# Altium schematic sheet Power.SchDoc
size A; DocumentNumber: 5; SheetNumber: 5; SheetTotal: 5
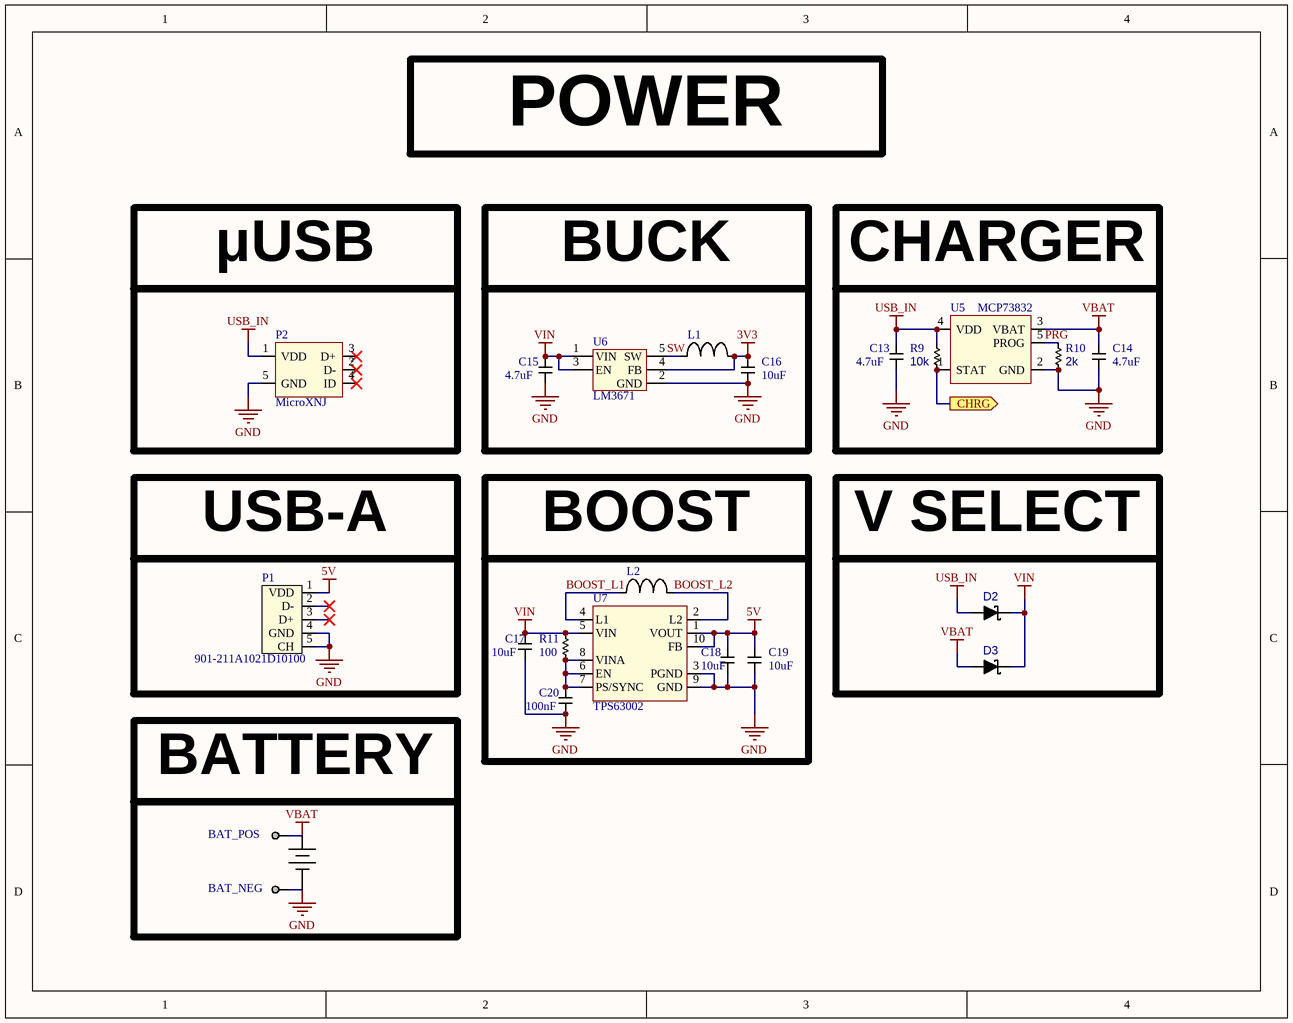
[diagram p0: Power.SchDoc]

## Parts
BAT_NEG  18 AWG Hole  [18 AWG Hole]  (value not drawn)  (no BOM)
BAT_POS  18 AWG Hole  [18 AWG Hole]  (value not drawn)  (no BOM)
C13  4.7uF  [CAP_0402_HIGH]
C14  4.7uF  [CAP_0402_HIGH]
C15  4.7uF  [CAP_0603_HIGH]
C16  10uF  [CAP_0603_HIGH]
C17  10uF  [CAP_0603_HIGH]
C18  10uF  [CAP_0603_HIGH]
C19  10uF  [CAP_0603_HIGH]
C20  100nF  [CAP_0402_HIGH]
D2  CUS10S30,H3F  [CUS10S30,H3F]  (value not drawn)
D3  CUS10S30,H3F  [CUS10S30,H3F]  (value not drawn)
L1  YNR3015-2R2M  [YNR3015-2R2M]  (value not drawn)
L2  YNR3015-2R2M  [YNR3015-2R2M]  (value not drawn)
P1  901-211A1021D10100  [901-211A1021D10100]
P2  MicroXNJ  [MicroXNJ]
R9  10k  [RES_0402_HIGH]
R10  2k  [RES_0402_HIGH]
R11  100  [RES_0402_HIGH]
U5  MCP73832  [MCP73831]
U6  LM3671  [LM3671-SOT23]
U7  TPS63002  [TPS63001]

## Ports
CHRG (out)

## Nets
3V3: C16.2 L1.2 U6.4(FB)
5V: C18.2 C19.2 P1.1(VDD) U7.1(VOUT) U7.10(FB)
GND: BAT_NEG.1 C13.1 C14.1 C15.1 C16.1 C17.1 C18.1 C19.1 C20.1 P1.4(GND) P1.5(CH) P2.5(GND) R10.2 U5.2(GND) U6.2(GND) U7.3(PGND) U7.9(GND)
USB_IN: C13.2 D2.2 P2.1(VDD) R9.1 U5.4(VDD)
VBAT: BAT_POS.1 C14.2 D3.2 U5.3(VBAT)
VIN: C15.2 C17.2 D2.1 D3.1 R11.2 U6.1(VIN) U6.3(EN) U7.5(VIN)
BOOST_L1: L2.1 U7.4(L1)
BOOST_L2: L2.2 U7.2(L2)
CHRG: R9.2 U5.1(STAT) ; port CHRG
PRG: R10.1 U5.5(PROG)
SW: L1.1 U6.5(SW)
NetC20_2: C20.2 R11.1 U7.6(EN) U7.7(PS/SYNC) U7.8(VINA)

Not connected (* = marked no-connect by the designer): P1 2(D-)* 3(D+)*; P2 2(D-)* 3(D+)* 4(ID)*

## Notes on the sheet
- POWER
- μUSB
- BUCK
- CHARGER
- (near P1) USB-A
- (near L2) BOOST
- V SELECT
- (near BAT_POS) BATTERY

## Library data of the parts
C13 C14 C20 = Capacitor_0402: 0402 Capacitor
C15-C19 = Capacitor_0603: 0603 Capacitor
D2 D3 = CUS10S30,H3F: CUS10S30,H3F Diode Schottky 30V 1A Surface Mount USC
L1 L2 = YNR3015-2R2M: YNR3015-2R2M 2.2uH ±20% 1.6A 30mΩ SMD,3.0x3.0x1.5mm Power Inductors RoHS
P1 = 901-211A1021D10100: 901-211A1021D10100 USB - Type A Female USB 2.0 4 Through Hole USB Connectors RoHS
P2 = MicroXNJ: MicroXNJ USB - micro B USB 2.0 Receptacle Connector 5 Position Surface Mount, Right Angle; Through Hole
R9-R11 = Resistor_0402: 0402 Resistor
U5 = MCP73831: MCP73831 Charger IC Lithium-Ion/Polymer
U6 = LM3671: LM3671 IC REG BUCK 3.3V 0.6A SYNC 5USMD
U7 = TPS63001: TPS63001 Buck-Boost Switching Regulator IC Positive Fixed 5V 1 Output 1.6A (Switch) 10-VFDFN Exposed Pad